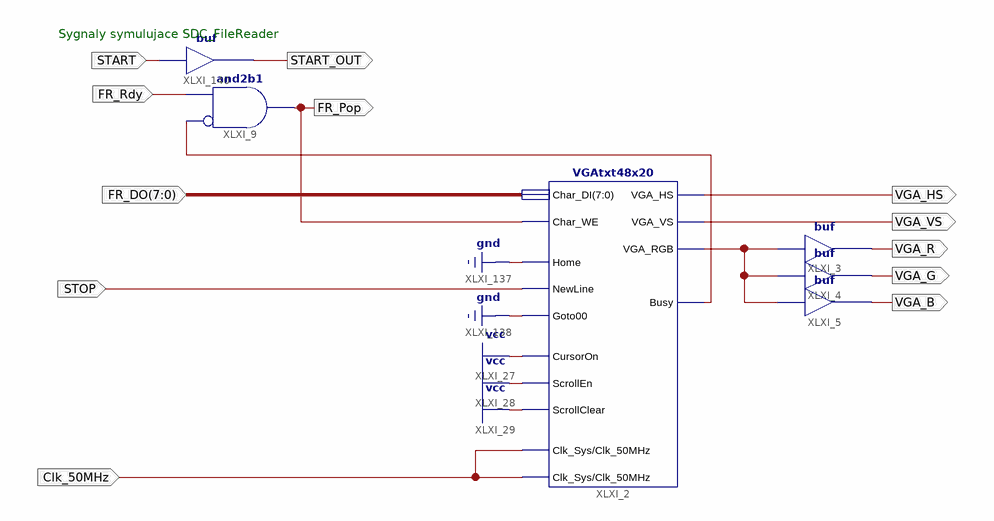
[diagram p0: schematic sheet 1]
// Xilinx ISE schematic typing_tutor.sch (spartan3e) as structural Verilog: 6 symbols, 12 ports
module typing_tutor (
  input  [7:0] FR_DO,
  input  STOP,
  input  Clk_50MHz,
  input  FR_Rdy,
  input  START,
  output VGA_VS,
  output VGA_HS,
  output VGA_G,
  output VGA_B,
  output VGA_R,
  output FR_Pop,
  output START_OUT
);

  wire XLXN_17, XLXN_564;

  buf XLXI_3 (VGA_R, XLXN_564);
  buf XLXI_4 (VGA_G, XLXN_564);
  buf XLXI_5 (VGA_B, XLXN_564);
  VGAtxt48x20 XLXI_2 (
    .Char_DI(FR_DO), .Home(1'b0), .NewLine(STOP), .Goto00(1'b0), .Clk_Sys(Clk_50MHz), .Clk_50MHz(Clk_50MHz),
    .CursorOn(1'b1), .ScrollEn(1'b1), .ScrollClear(1'b1), .Busy(XLXN_17), .VGA_HS(VGA_HS), .VGA_VS(VGA_VS),
    .VGA_RGB(XLXN_564), .Char_WE(FR_Pop));
  and XLXI_9 (FR_Pop, ~XLXN_17, FR_Rdy);  // and2b1
  buf XLXI_140 (START_OUT, START);

  // Notes on the sheet:
  //   Sygnaly symulujace SDC_FileReader
endmodule
